# Altium schematic sheet Sheet_PCB.SchDoc
size A4
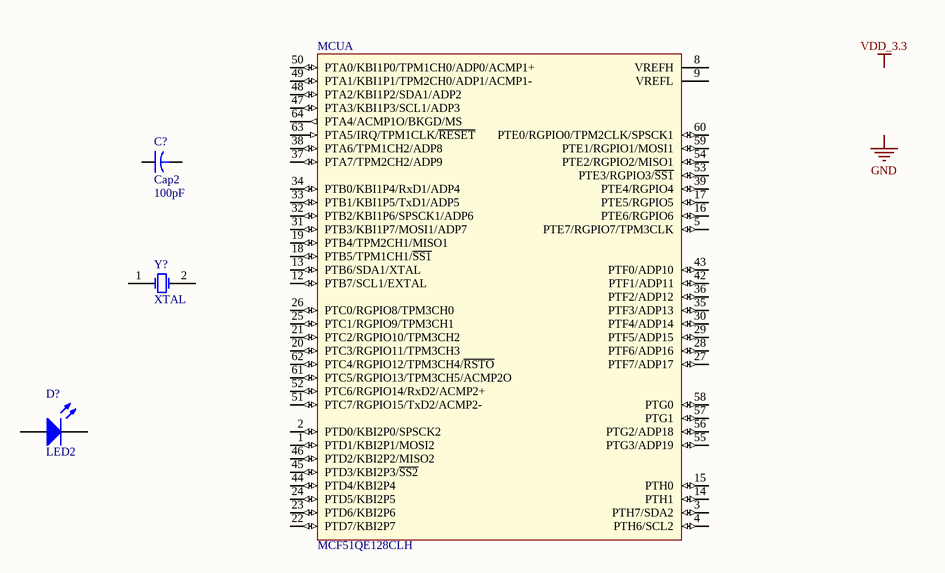
[diagram p0: Sheet_PCB.SchDoc]

## Parts
C?  Cap2  value 100pF  [CAPR5-4X5]
D?  LED2  [3.2X1.6X1.1]
MCU  MCF51QE128CLH  [840F-02_N]  (part A of 2)
Y?  XTAL  [R38]

## Nets

Not connected (* = marked no-connect by the designer): C? 1 2; D? 1(A) 2(K); MCU 1(PTD1/KBI2P1/MOSI2) 2(PTD0/KBI2P0/SPSCK2) 3(PTH7/SDA2) 4(PTH6/SCL2) 5(PTE7/RGPIO7/TPM3CLK) 8(VREFH) 9(VREFL) 12(PTB7/SCL1/EXTAL) 13(PTB6/SDA1/XTAL) 14(PTH1) 15(PTH0) 16(PTE6/RGPIO6) 17(PTE5/RGPIO5) 18(PTB5/TPM1CH1/~{SS1}) 19(PTB4/TPM2CH1/MISO1) 20(PTC3/RGPIO11/TPM3CH3) 21(PTC2/RGPIO10/TPM3CH2) 22(PTD7/KBI2P7) 23(PTD6/KBI2P6) 24(PTD5/KBI2P5) 25(PTC1/RGPIO9/TPM3CH1) 26(PTC0/RGPIO8/TPM3CH0) 27(PTF7/ADP17) 28(PTF6/ADP16) 29(PTF5/ADP15) 30(PTF4/ADP14) 31(PTB3/KBI1P7/MOSI1/ADP7) 32(PTB2/KBI1P6/SPSCK1/ADP6) 33(PTB1/KBI1P5/TxD1/ADP5) 34(PTB0/KBI1P4/RxD1/ADP4) 35(PTF3/ADP13) 36(PTF2/ADP12) 37(PTA7/TPM2CH2/ADP9) 38(PTA6/TPM1CH2/ADP8) 39(PTE4/RGPIO4) 42(PTF1/ADP11) 43(PTF0/ADP10) 44(PTD4/KBI2P4) 45(PTD3/KBI2P3/~{SS2}) 46(PTD2/KBI2P2/MISO2) 47(PTA3/KBI1P3/SCL1/ADP3) 48(PTA2/KBI1P2/SDA1/ADP2) 49(PTA1/KBI1P1/TPM2CH0/ADP1/ACMP1-) 50(PTA0/KBI1P0/TPM1CH0/ADP0/ACMP1+) 51(PTC7/RGPIO15/TxD2/ACMP2-) 52(PTC6/RGPIO14/RxD2/ACMP2+) 53(PTE3/RGPIO3/~{SS1}) 54(PTE2/RGPIO2/MISO1) 55(PTG3/ADP19) 56(PTG2/ADP18) 57(PTG1) 58(PTG0) 59(PTE1/RGPIO1/MOSI1) 60(PTE0/RGPIO0/TPM2CLK/SPSCK1) 61(PTC5/RGPIO13/TPM3CH5/ACMP2O) 62(PTC4/RGPIO12/TPM3CH4/~{RSTO}) 63(PTA5/IRQ/TPM1CLK/~{RESET}) 64(PTA4/ACMP1O/BKGD/MS); Y? 1(OSC1) 2(OSC2)

## Notes on the sheet
- Labels drawn without touching a wire or pin: GND, VDD_3.3

## Library data of the parts
C? = Cap2: Capacitor; Published: 23-Sep-2002; PackageReference: CAPR5-4X5; Publisher: Altium Limited; PackageDescription: Capacitor; 2 Leads
D? = LED2: Typical RED, GREEN, YELLOW, AMBER GaAs LED; Published: 8-Jun-2000; LatestRevisionDate: 17-Jul-2002; LatestRevisionNote: Re-released for DXP Platform.; PackageVersion: Feb-2002; PackageReference: 3.2X1.6X1.1; Publisher: Altium Limited; PackageDescription: SM LED; 2 Flat Leads
MCU = MCF51QE128CLH: MCF51QE128 ColdFire V1 Microcontroller, 32-Bit, 128KB Flash, 8KB RAM, -40°C to 85°C, 64-Pin LQFP; DatasheetVersion: rev7, Oct-2008; PackageVersion: rev6, Mar-2011; PackageReference: 840F-02; PackageDescription: 64-Pin Thin Quad Flat Pack, 10 x 10 mm Body, 0.5 mm Pitch; ComponentLink1Description: Manufacturer URL; ComponentLink1URL: http://www.freescale.com/; ComponentLink2Description: Datasheet; ComponentLink2URL: http://cache.freescale.com/files/32bit/doc/data_sheet/MCF51QE128.pdf?fpsp=1&WT_TYPE=Data%20Sheets&WT_VENDOR=FREESCALE&WT_FILE_FORMAT=pdf&WT_ASSET=Documentation
Y? = XTAL: Crystal Oscillator; Published: 8-Jun-2000; LatestRevisionDate: 17-Jul-2002; LatestRevisionNote: Re-released for DXP Platform.; PackageReference: R38; Publisher: Altium Limited; PackageDescription: Crystal, Thru-Hole; 2 Leads; Body 3.1 x 8.2 mm (Dia.xH)